# EAGLE design diodeBoard (EAGLE 9.5.0)
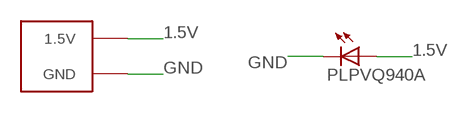
[diagram p0: schematic, sheet 1]

## Parts
U$1  2PIN  [2PIN]
U$2  PLPVQ940A  [PLPVQ940A]

## Nets
1.5V: U$1.P$2(1.5V) U$2.P$1(A)
GND: U$1.P$1(GND) U$2.P$2(C)

## Library data of the parts
U$1 = _HenrySilva:2PIN
U$2 = _HenrySilva:PLPVQ940A

## Board
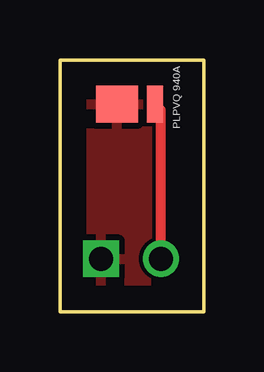
[diagram p1: board, top side]
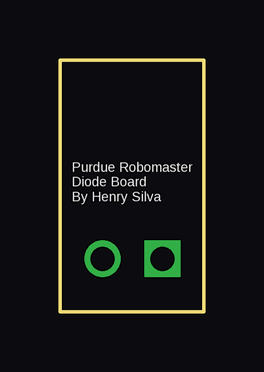
[diagram p2: board, bottom side, seen from below]

Size 6 x 10.5 mm. Coordinates in mm from the lower left corner, seen from the top.
Outline: 0,0 6,0 6,10.5 0,10.5 0,0
Copper layers (1*16): Top 0.035mm / dielectric 1.5mm / Bottom 0.035mm
Design rules "default": minimum track width 6mil, minimum drill 0.35mm, track to track 6mil, track to pad 6mil, pad to pad 6mil, via to via 6mil, smd to smd 6mil, copper to edge 40mil, drill to drill 6mil, minimum pad ring 10mil, minimum via ring 8mil, stop-mask expansion 4mil, vias tented up to drill 0mil, thermal gap 10mil

### Footprints (pad centres in the part's own frame; a part is rotated, then mirrored left to right if it is on the bottom)
2PIN = drill 1 square: P$1 0,0 | drill 1: P$2 2.5,0
PLPVQ940A = smd 1.55 x 0.65: P$1 0.78,0.33 | smd 1.55 x 1.75: P$2 0.78,1.925

### Placement (x,y rotation side)
U$1  1.71,2.21 0 top
U$2  4.3,7.87 90 top

### Tracks (layer width: path | path; a pad name or v marks a point on that pad's centre or on a via)
1.5V
  Top 0.406: U$1.P$2 4.21,8.41 U$2.P$1
GND
  pour Top: 0,10.5 0,0 6.5,0 6.5,10.5

### Text on the board
bPlace: Purdue Robomaster / Diode Board / By Henry Silva